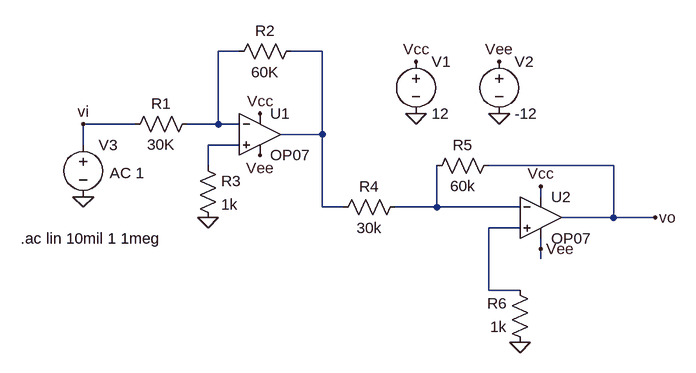
[diagram p0: schematic GBW_opamp.asc]
GBW_opamp.asc, the LTspice schematic file:
Version 4
SHEET 1 880 680
WIRE 96 32 64 32
WIRE 224 32 176 32
WIRE -64 144 -144 144
WIRE 64 144 64 32
WIRE 64 144 16 144
WIRE 96 144 64 144
WIRE 224 160 224 32
WIRE 224 160 160 160
WIRE -144 176 -144 144
WIRE 96 176 48 176
WIRE 48 208 48 176
WIRE 672 208 480 208
WIRE 560 256 560 240
WIRE 224 272 224 160
WIRE 256 272 224 272
WIRE 400 272 400 208
WIRE 400 272 336 272
WIRE 528 272 400 272
WIRE 672 288 672 208
WIRE 672 288 592 288
WIRE 736 288 672 288
WIRE 528 304 480 304
WIRE 560 336 560 320
WIRE 560 352 560 336
WIRE 480 400 480 304
WIRE 528 400 480 400
FLAG 368 128 0
FLAG 368 48 Vcc
FLAG 496 128 0
FLAG 496 48 Vee
FLAG 128 128 Vcc
FLAG 128 192 Vee
FLAG 736 288 vo
FLAG 48 288 0
FLAG -144 256 0
FLAG -144 144 vi
FLAG 528 480 0
FLAG 560 240 Vcc
FLAG 560 336 Vee
SYMBOL voltage 368 32 R0
WINDOW 123 0 0 Left 0
WINDOW 39 0 0 Left 0
SYMATTR InstName V1
SYMATTR Value 12
SYMBOL voltage 496 32 R0
WINDOW 123 0 0 Left 0
WINDOW 39 0 0 Left 0
SYMATTR InstName V2
SYMATTR Value -12
SYMBOL res 32 128 R90
WINDOW 0 0 56 VBottom 2
WINDOW 3 32 56 VTop 2
SYMATTR InstName R1
SYMATTR Value 30K
SYMBOL res 192 16 R90
WINDOW 0 0 56 VBottom 2
WINDOW 3 32 56 VTop 2
SYMATTR InstName R2
SYMATTR Value 60K
SYMBOL res 32 192 R0
SYMATTR InstName R3
SYMATTR Value 1k
SYMBOL voltage -144 160 R0
WINDOW 3 -97 138 Left 2
WINDOW 123 41 59 Left 2
WINDOW 39 0 0 Left 0
SYMATTR Value ""
SYMATTR Value2 AC 1
SYMATTR InstName V3
SYMBOL Opamps\\OP07 128 96 R0
SYMATTR InstName U1
SYMBOL OpAmps\\OP07 560 224 R0
SYMATTR InstName U2
SYMBOL res 352 256 R90
WINDOW 0 0 56 VBottom 2
WINDOW 3 32 56 VTop 2
SYMATTR InstName R4
SYMATTR Value 30k
SYMBOL res 496 192 R90
WINDOW 0 0 56 VBottom 2
WINDOW 3 32 56 VTop 2
SYMATTR InstName R5
SYMATTR Value 60k
SYMBOL res 544 496 R180
WINDOW 0 36 76 Left 2
WINDOW 3 36 40 Left 2
SYMATTR InstName R6
SYMATTR Value 1k
TEXT -240 320 Left 2 !.ac lin 10mil 1 1meg

The netlist it stands for:
* GBW_opamp.asc
V1 Vcc 0 12
V2 Vee 0 -12
R1 N001 vi 30K
R2 N002 N001 60K
R3 N003 0 1k
V3 vi 0 AC 1
XU1 N003 N001 Vcc Vee N002 LT1001  ; OP07, pins In+ In- V+ V- OUT
XU2 N005 N004 Vcc Vee vo LT1001  ; OP07, pins In+ In- V+ V- OUT
R4 N004 N002 30k
R5 vo N004 60k
R6 0 N005 1k
.ac lin 10mil 1 1meg
.lib LTC.lib
.backanno
.end